# EasyEDA schematic SCH_Orto-Idroponico_2021-11-15.json
TITLE: Orto Idroponico; REV: 2.1; Date: 2021-11-10; Sheet: 1/1; Drawn By: francesco-scar; Company: Fablab Imperia
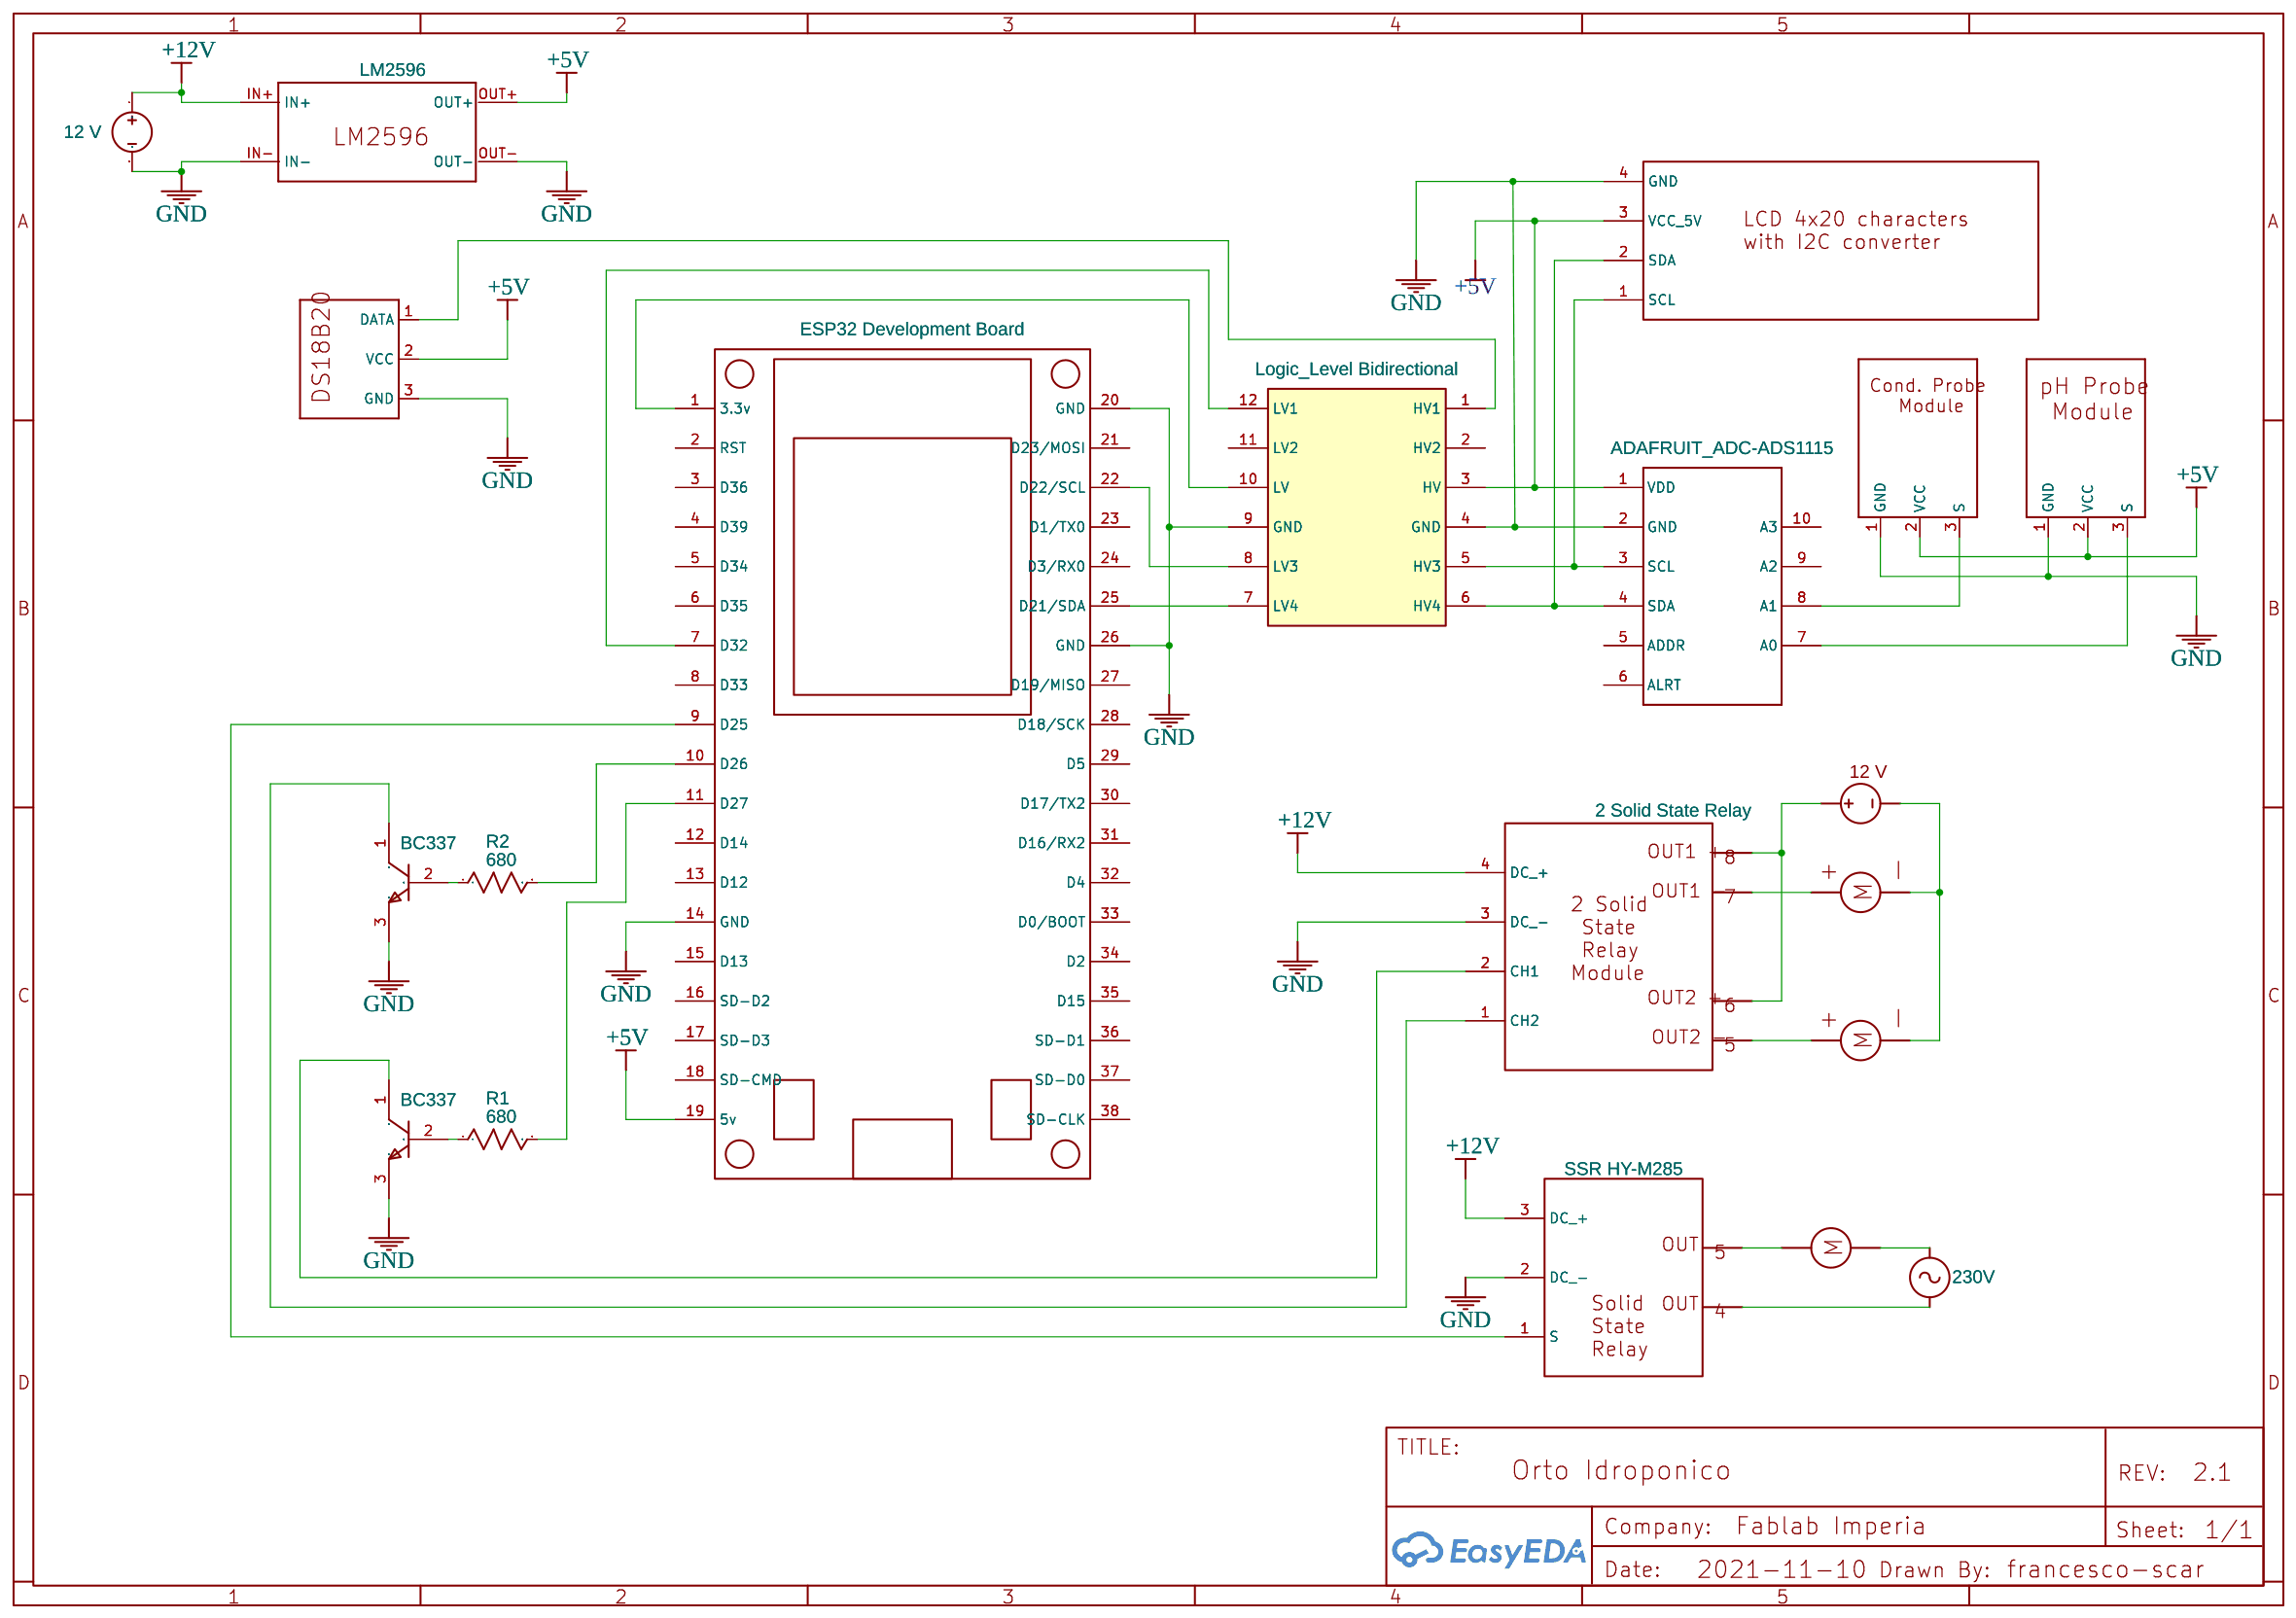
[diagram p0: schematic sheet]

## Parts
2  ADAFRUIT_ADC-ADS1115  [ADC-4CH-ADS1115]
230V  AC source no pins  [EMPTY FOOTPRINT]
P2  Logic_Level Bidirectional  [LOGIC_LEVEL BIDIRECTIONAL]
Q1  BC337  [ONSC-TO-92-3-29-11_AM_BL]
Q2  BC337  [ONSC-TO-92-3-29-11_AM_BL]
R1  680  [RESISTOR 10MM]
R2  680  [RESISTOR 10MM]
REG2  LM2596  [LM2596]
T1  DS18B20  [DS18B20]
T2  pH probe module  [PROBE CONNECTOR]
T3  conductivity probe module  [PROBE CONNECTOR]
U1  ESP32 Development Board  [ESP32 DEVELOPMENT BOARD ROTATED]
U2  2 Solid State Relay  [2 SOLID STATE RELAY]
U3  Nettigo LCD 4x20 I2C  [LCD 4X20 I2C]
U4  DC power source no pin  [EMPTY FOOTPRINT]
U5  SSR HY-M285  [SSR HY-M285]
U7  DC Motor no pin  [EMPTY FOOTPRINT]
U8  DC Motor no pin  [EMPTY FOOTPRINT]
U9  DC Motor no pin  [EMPTY FOOTPRINT]
V1  12 V  [POWER PIN + -]

## Library data of the parts
2 = ADAFRUIT_ADC-ADS1115: Contributor: Contributor
230V = AC source no pins: Contributor: Contributor; license: https://www.gnu.org/licenses/lgpl-2.1.html
P2 = Logic_Level Bidirectional: sourceId: ldJDwO6oi; Contributor: Contributor
Q1 Q2 = BC337-40RL1G: Amplifier Transistor, NPN Silicon, 3-Pin TO-92, Pb-Free, Tape and Reel
R1 R2 = R_AXIAL-1.2_US: Contributor: LCEDA_Lib
REG2 = LM2596: Contributor: Kevin Kwok
T1 = DS18B20: Contributor: Contributor
T2 = pH probe module: Contributor: Contributor
T3 = conductivity probe module: Contributor: Contributor
U1 = ESP32 Development Board: Contributor: drfailov
U2 = 2 Solid State Relay: Contributor: Contributor
U3 = Nettigo LCD 4x20 I2C: Manufacturer Part: 2004A; link: https://nettigo.eu/products/lcd-4x20-i2c-blue; Contributor: irukard
U4 = DC power source no pin: Contributor: Contributor
U5 = Solid State Relay SSR HY-M285: Contributor: Contributor
U7-U9 = DC Motor no pin: Contributor: Contributor
V1 = DC Power Source: Contributor: usauter

## Nets
+5V: 2.1(VDD) P2.3(HV) REG2.OUT+ T1.2(VCC) T2.2(VCC) T3.2(VCC) U1.19(5v) U3.3(VCC 5V)
+12V: REG2.IN+ U2.4(DC +) U5.3(DC +) V1.1
GND: 2.2(GND) P2.4(GND) P2.9(GND) Q1.3(E) Q2.3(E) REG2.IN- REG2.OUT- T1.3(GND) T2.1(GND) T3.1(GND) U1.14(GND) U1.20(GND) U1.26(GND) U2.3(DC -) U3.4(GND) U5.2(DC -) V1.2
Net-(2-3): 2.3(SCL) P2.5(HV3) U3.1(SCL)
Net-(2-4): 2.4(SDA) P2.6(HV4) U3.2(SDA)
Net-(2-7): 2.7(A0) T2.3(S)
Net-(2-8): 2.8(A1) T3.3(S)
Net-(P2-1): P2.1(HV1) T1.1(DATA)
Net-(P2-7): P2.7(LV4) U1.25(D21/SDA)
Net-(P2-8): P2.8(LV3) U1.22(D22/SCL)
Net-(P2-10): P2.10(LV) U1.1(3.3v)
Net-(P2-12): P2.12(LV1) U1.7(D32)
Net-(Q1-1): Q1.1(C) U2.1(CH2)
Net-(Q1-2): Q1.2(B) R2.1
Net-(Q2-1): Q2.1(C) U2.2(CH1)
Net-(Q2-2): Q2.2(B) R1.1
Net-(R1-2): R1.2 U1.11(D27)
Net-(R2-2): R2.2 U1.10(D26)
Net-(U1-9): U1.9(D25) U5.1(S)

Not connected (* = marked no-connect by the designer): 2 5(ADDR) 6(ALRT) 9(A2) 10(A3); P2 2(HV2) 11(LV2); U1 2(RST) 3(D36) 4(D39) 5(D34) 6(D35) 8(D33) 12(D14) 13(D12) 15(D13) 16(SD-D2) 17(SD-D3) 18(SD-CMD) 21(D23/MOSI) 23(D1/TX0) 24(D3/RX0) 27(D19/MISO) 28(D18/SCK) 29(D5) 30(D17/TX2) 31(D16/RX2) 32(D4) 33(D0/BOOT) 34(D2) 35(D15) 36(SD-D1) 37(SD-D0) 38(SD-CLK)
